# EAGLE design GMO-00001 (EAGLE 5.11)
REV: 0.1; URL: https://github.com/geekammo/GMO-00001
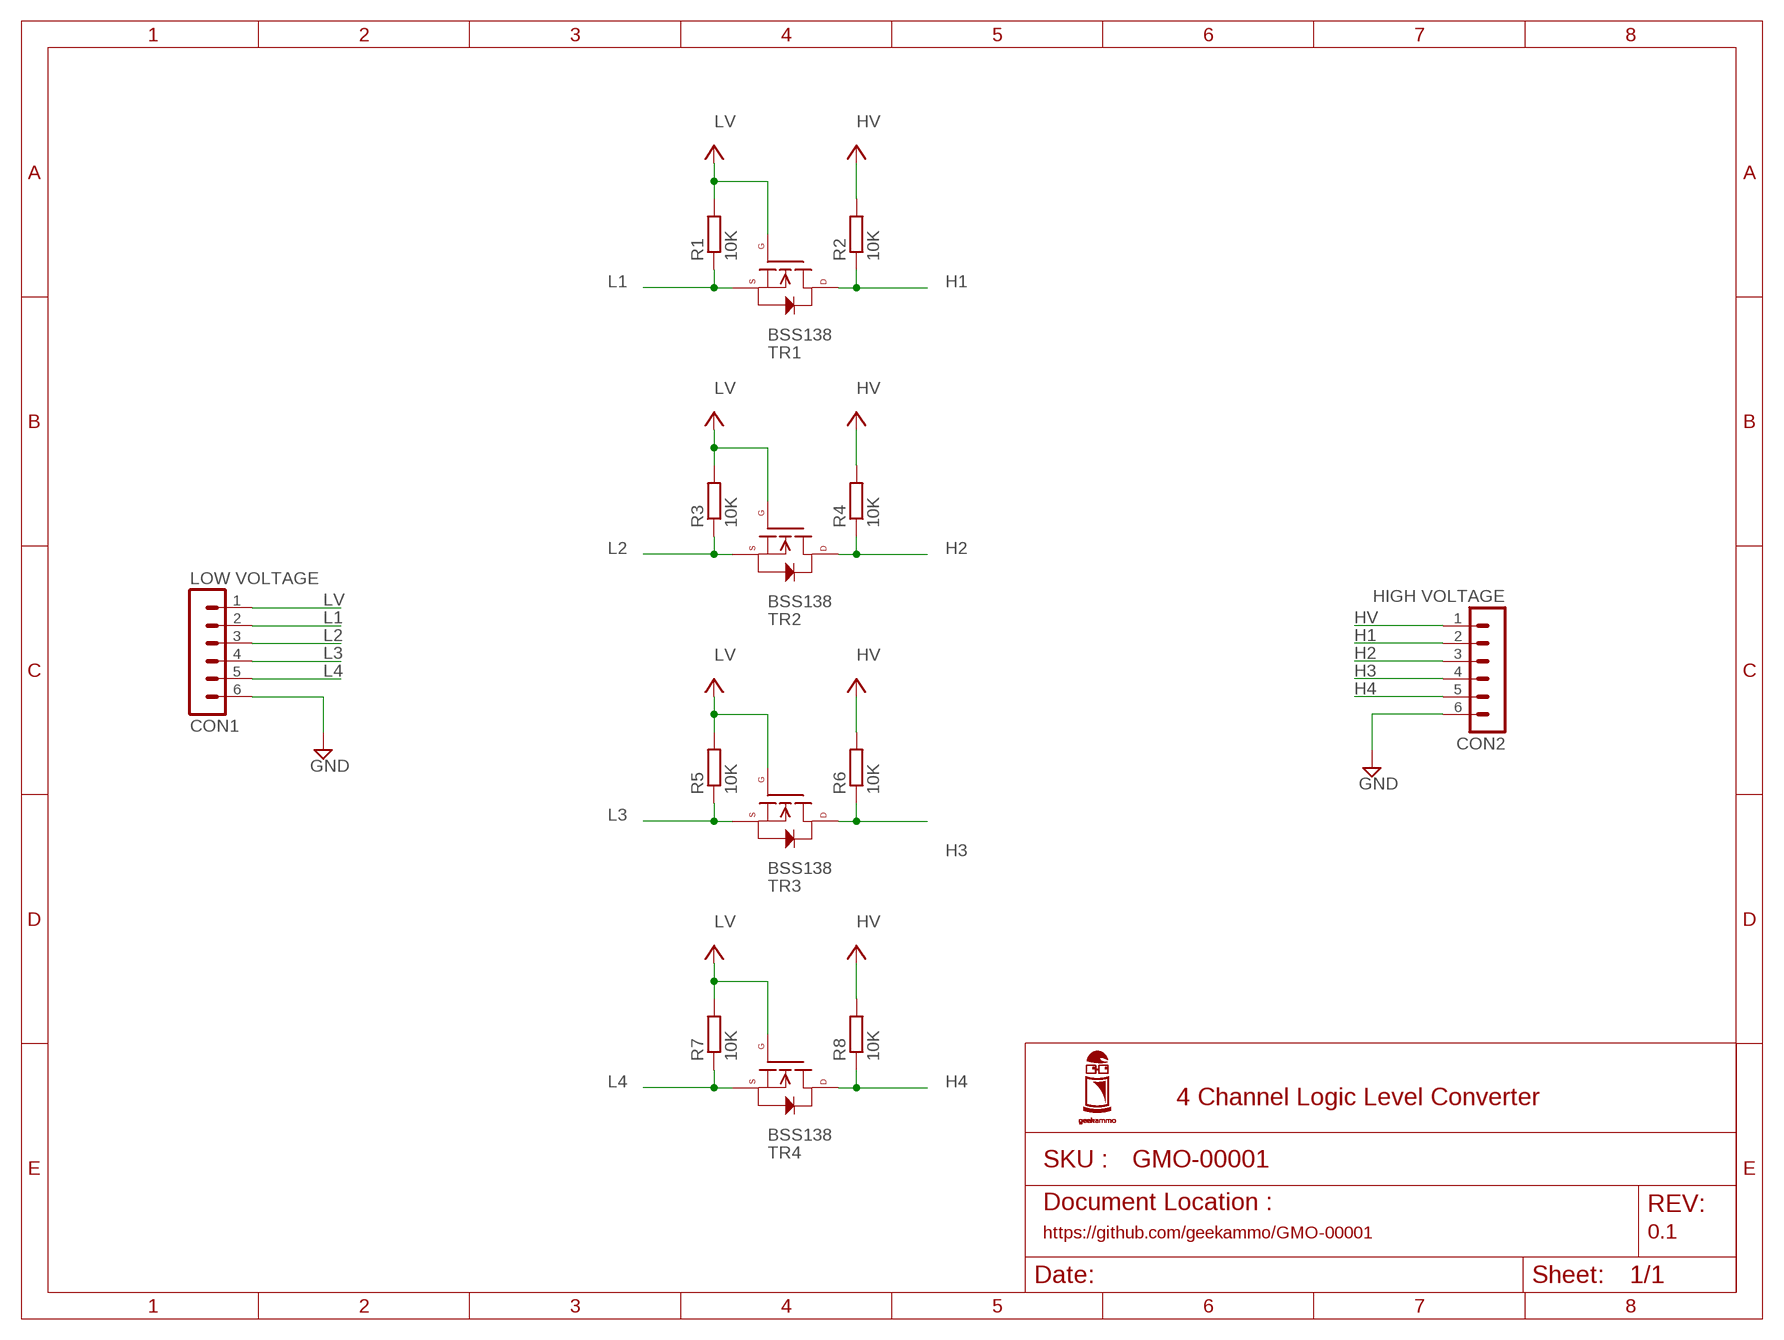
[diagram p0: schematic, sheet 1]

## Parts
CON1  LOW VOLTAGE  PINHEADER_6X1  [MA06-1-OCTAGON]
CON2  HIGH VOLTAGE  PINHEADER_6X1  [MA06-1-OCTAGON]
R1  10K  R-EU_R0603  [R0603]
R2  10K  R-EU_R0603  [R0603]
R3  10K  R-EU_R0603  [R0603]
R4  10K  R-EU_R0603  [R0603]
R5  10K  R-EU_R0603  [R0603]
R6  10K  R-EU_R0603  [R0603]
R7  10K  R-EU_R0603  [R0603]
R8  10K  R-EU_R0603  [R0603]
TR1  BSS138  N-CHANNEL-MOSFET  [SOT23]
TR2  BSS138  N-CHANNEL-MOSFET  [SOT23]
TR3  BSS138  N-CHANNEL-MOSFET  [SOT23]
TR4  BSS138  N-CHANNEL-MOSFET  [SOT23]

## Nets
GND: CON1.6 CON2.6
H1: CON2.2 R2.1 TR1.3(D)
H2: CON2.3 R4.1 TR2.3(D)
H3: CON2.4 R6.1 TR3.3(D)
H4: CON2.5 R8.1 TR4.3(D)
HV: CON2.1 R2.2 R4.2 R6.2 R8.2
L1: CON1.2 R1.1 TR1.2(S)
L2: CON1.3 R3.1 TR2.2(S)
L3: CON1.4 R5.1 TR3.2(S)
L4: CON1.5 R7.1 TR4.2(S)
LV: CON1.1 R1.2 R3.2 R5.2 R7.2 TR1.1(G) TR2.1(G) TR3.1(G) TR4.1(G)

## Notes on the sheet
- 4 Channel Logic Level Converter

## Library data of the parts
CON1 CON2 = GeekAmmo:PINHEADER_6X1: 6 x 0.1 inch Through Hole Pin Header
R1-R8 = resistor:R-EU_: RESISTOR, European symbol
TR1-TR4 = GeekAmmo:N-CHANNEL-MOSFET: N-Channel Logic Level Enhancement Mode Field Effect Transistor

## Board
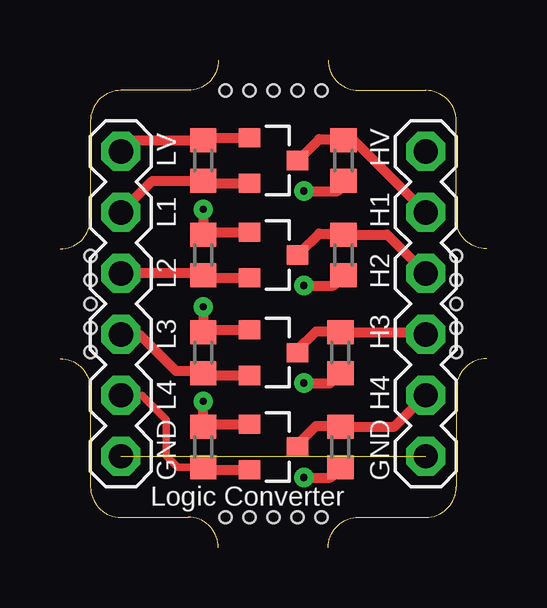
[diagram p1: board, top side]
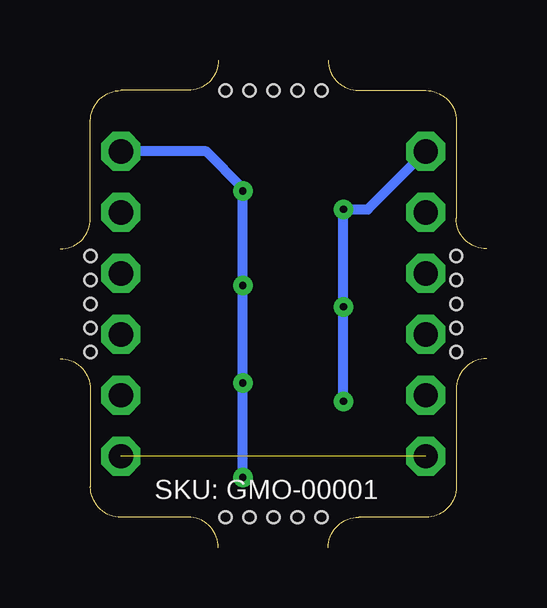
[diagram p2: board, bottom side, seen from below]

Size 17.78 x 20.32 mm. Coordinates in mm from the lower left corner, seen from the top.
Outline: 16.51,17.78 arc90 15.24,19.05
Outline: 6.6,20.32 arc-90 5.33,19.05 2.54,19.05 arc90 1.27,17.78 1.27,13.72 arc-90 0,12.45
Outline: 11.18,20.32 arc90 12.45,19.05 15.24,19.05
Outline: 11.18,0 arc-90 12.45,1.27 15.24,1.27 arc90 16.51,2.54 16.51,6.6 arc-90 17.78,7.87
Outline: 6.6,0 arc90 5.33,1.27 2.54,1.27 arc-90 1.27,2.54 1.27,6.6 arc90 0,7.87
Outline: 17.78,12.45 arc-90 16.51,13.72 16.51,17.78
Outline: 16.51,17.78 arc90 15.24,19.05
Copper layers (1*16): Top 0.035mm / dielectric 1.5mm / Bottom 0.035mm
Design rules "SparkFun": minimum track width 8mil, minimum drill 20mil, track to track 8mil, track to pad 8mil, pad to pad 8mil, via to via 8mil, smd to smd 8mil, copper to edge 10mil, drill to drill 8mil, minimum pad ring 12mil, minimum via ring 10mil, stop-mask expansion 4mil, vias tented up to drill 25mil, thermal gap 10mil
Holes 0.5 mm at 7.89,19.05 6.89,19.05 8.89,19.05 9.89,19.05 10.89,19.05 9.89,1.27 10.89,1.27 8.89,1.27 7.89,1.27 6.89,1.27 16.51,11.16 16.51,12.16 16.51,10.16 16.51,9.16 16.51,8.16 1.27,9.16 1.27,8.16 1.27,10.16 1.27,11.16 1.27,12.16

### Footprints (pad centres in the part's own frame; a part is rotated, then mirrored left to right if it is on the bottom)
MA06-1-OCTAGON = drill 1.016 octagon: 1 -6.35,0; 2 -3.81,0; 3 -1.27,0; 4 1.27,0; 5 3.81,0; 6 6.35,0
R0603 = smd 1 x 1.1: 1 -0.85,0; 2 0.85,0
SOT23 = smd 0.8 x 0.9: 1 -0.95,-1; 2 0.95,-1; 3 0,1

### Placement (x,y rotation side)
CON1  2.54,10.16 270 top
CON2  15.24,10.16 270 top
R1  5.97,16.13 90 top
R2  11.81,16.13 270 top
R3  5.97,12.19 90 top
R4  11.81,12.19 270 top
R5  5.97,8.13 90 top
R6  11.68,8.13 270 top
R7  5.97,4.19 90 top
R8  11.68,4.19 270 top
TR1  8.89,16.13 270 top
TR2  8.89,12.19 270 top
TR3  8.89,8.13 270 top
TR4  8.89,4.19 270 top

### Tracks (layer width: path | path; a pad name or v marks a point on that pad's centre or on a via)
GND  (1 unrouted)
H1
  Top 0.406: CON2.2 12.23,16.98 R2.1 11.77,17.02 10.79,17.02 9.91,16.13 TR1.3
H2
  Top 0.406: TR2.3 9.89,12.3 10.02,12.3 10.79,13.08 11.77,13.08 R4.1 13.63,13.04 CON2.3
H3
  Top 0.406: R6.1 11.39,9.14 | TR3.3 9.89,8.24 10.67,9.02 11.64,9.02 R6.1 | R6.1 15.15,8.98 CON2.4
H4
  Top 0.406: TR4.3 9.91,4.19 9.91,4.32 10.67,5.08 11.64,5.08 R8.1 | R8.1 11.6,4.95 | R8.1 13.93,5.04 CON2.5
HV  (via drill 0.3)
  Top 0.406: v10.16,6.86 11.26,6.86 R6.2 | v10.16,2.92 11.26,2.92 R8.2 | v10.16,10.92 11.39,10.92 R4.2 | R2.2 11.81,15.11 11.56,14.86 v10.16,14.86
  Bottom 0.406: v10.16,2.92 v10.16,6.86 v10.16,10.92 v10.16,14.86 10.16,14.99 11.68,16.51 CON2.1
L1
  Top 0.406: TR1.2 6.07,15.18 R1.1 3.85,15.28 CON1.2
L2
  Top 0.406: TR2.2 6.07,11.24 R3.1 5.88,11.43 CON1.3
L3
  Top 0.406: TR3.2 6.07,7.18 R5.1 5.88,7.37 4.83,7.37 3.3,8.89 CON1.4
L4
  Top 0.305: R7.1 4.91,3.34 4.42,3.83 4.42,5.33 3.4,6.35 CON1.5
  Top 0.406: TR4.2 6.07,3.24 R7.1
LV  (via drill 0.3)
  Top 0.406: v5.97,14.1 R3.2 6.07,13.14 TR2.1 | v5.97,10.03 R5.2 6.07,9.08 TR3.1 | v5.97,6.1 R7.2 6.07,5.14 TR4.1 | TR1.1 6.07,17.08 R1.2 3.01,16.98 CON1.1
  Bottom 0.406: v5.97,6.1 v5.97,10.03 v5.97,14.1 4.95,14.1 CON1.1

### Text on the board
tPlace: LV | HV | L1 | H1 | L2 | H2 | L3 | H3 | L4 | H4 | GND | GND | Logic Converter
bPlace: SKU: GMO-00001